# EAGLE schematic TheSiS (EAGLE 9.6.2)
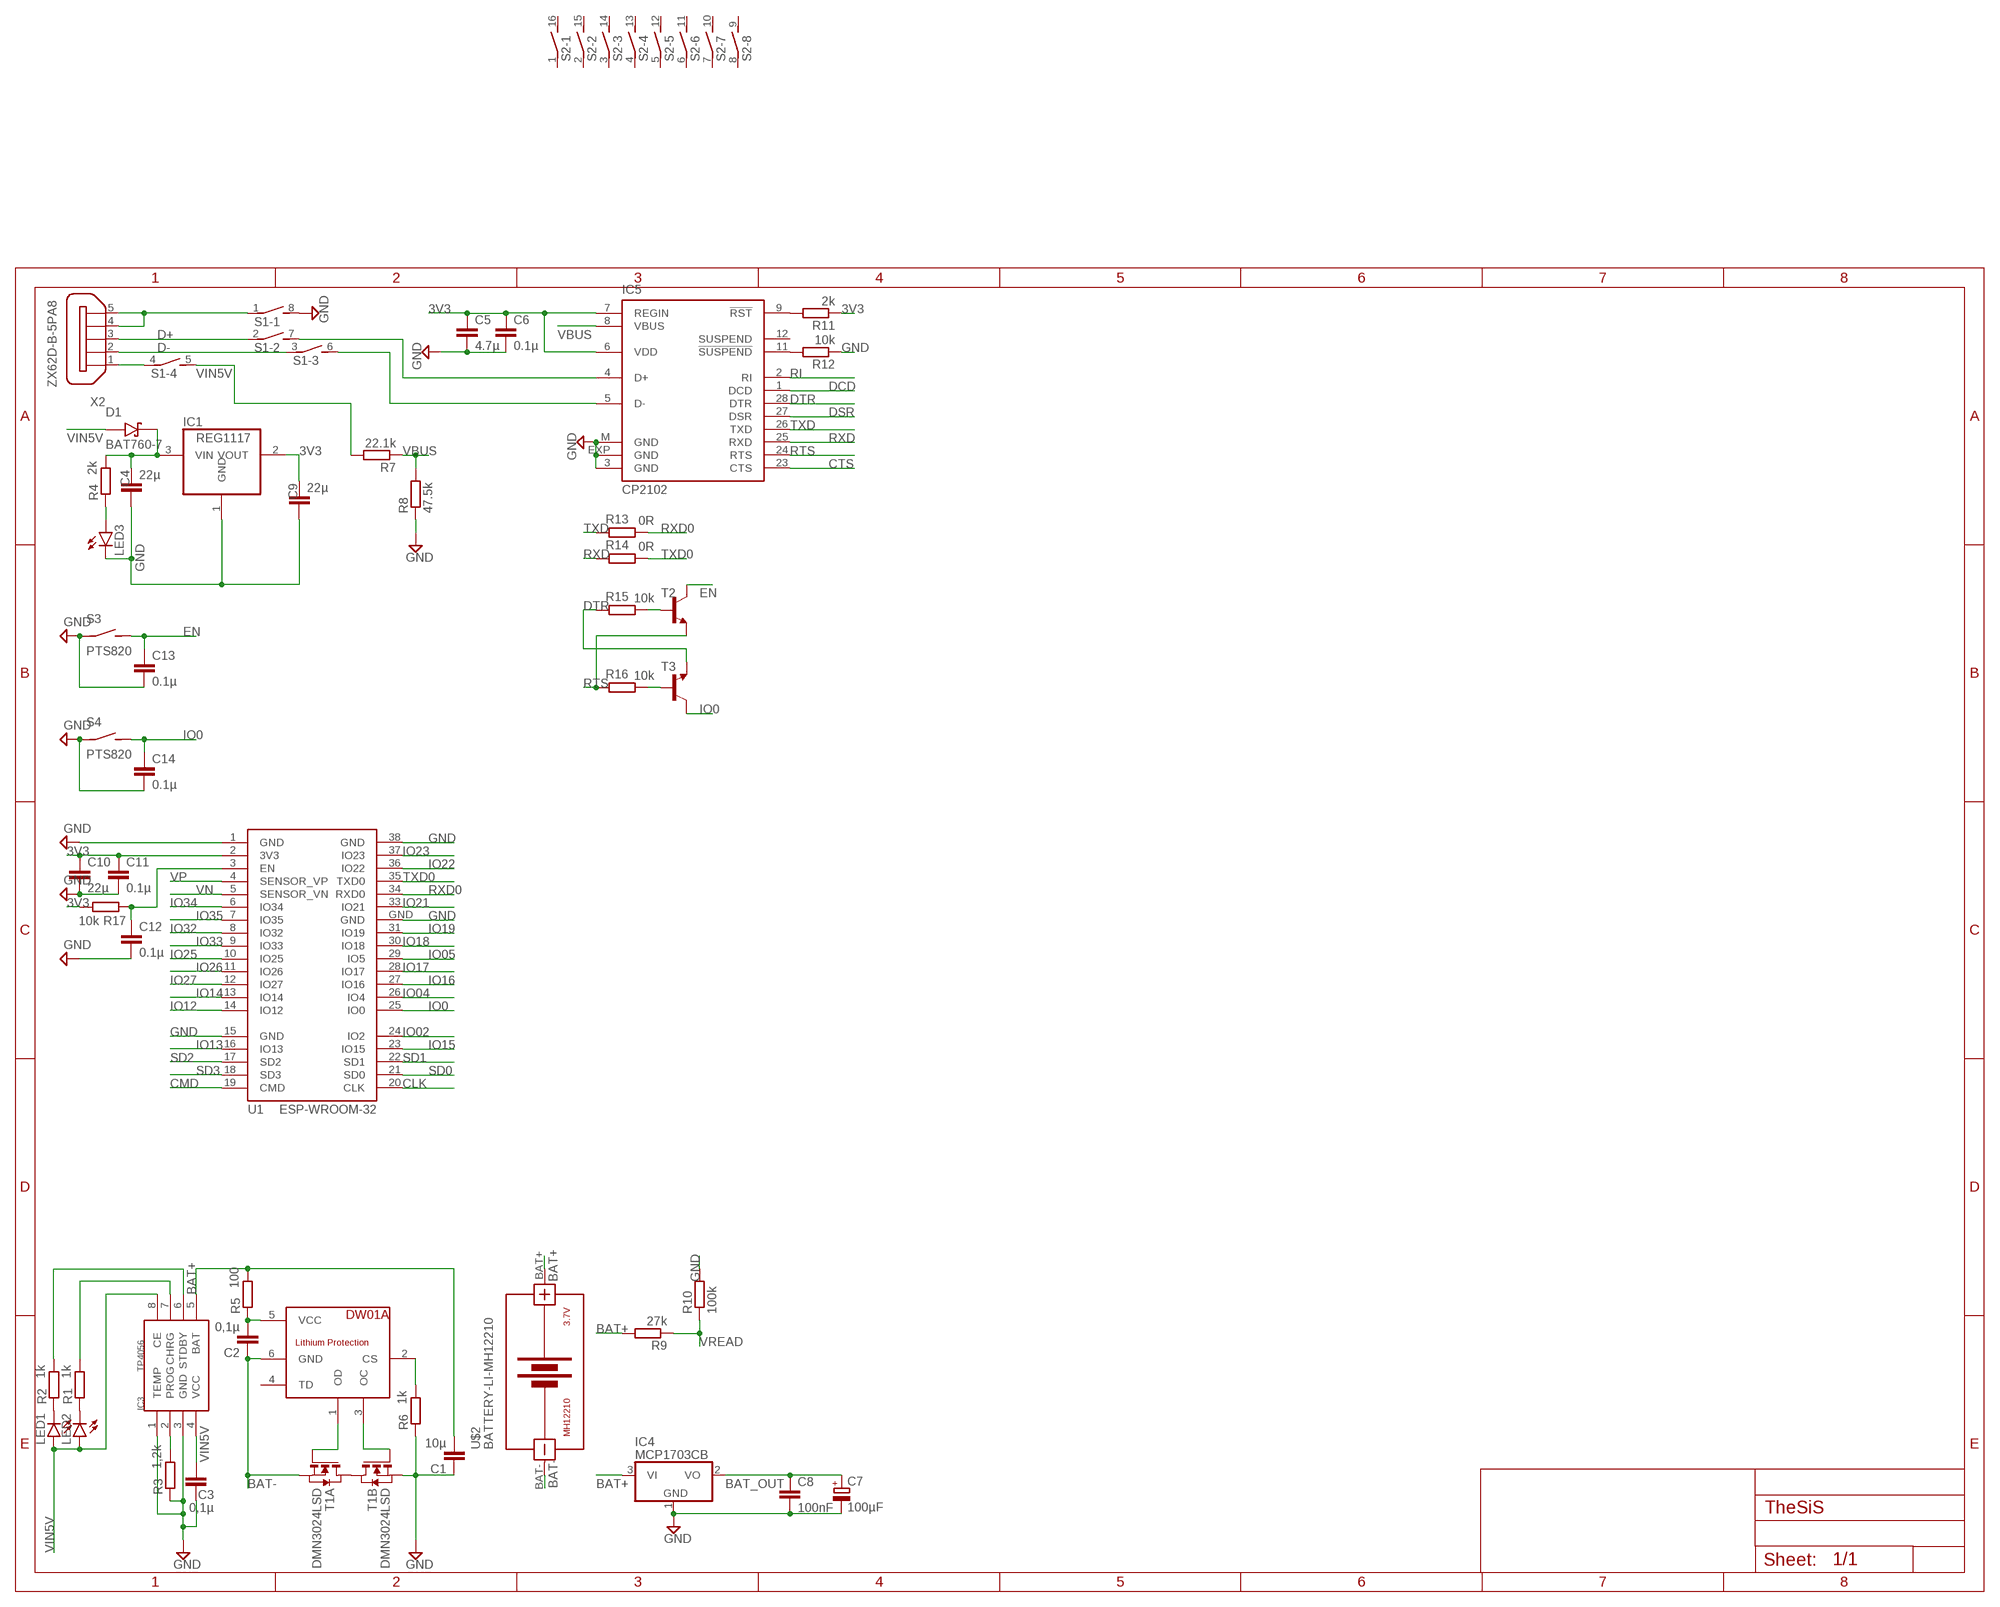
[diagram p0: schematic, sheet 1]

## Parts
C1  10µ  C-EUC0603K  [C0603K]
C2  0,1µ  C-EUC0805K  [C0805K]
C3  0,1µ  C-EUC0805K  [C0805K]
C4  22µ  C-EUC0805  [C0805]
C5  4.7µ  C-EUC0805  [C0805]
C6  0.1µ  C-EUC0805  [C0805]
C7  100µF  CPOL-EUE2,5-6E  [E2,5-6E]
C8  100nF  C-EUC0805  [C0805]
C9  22µ  C-EUC0805  [C0805]
C10  22µ  C-EUC0805  [C0805]
C11  0.1µ  C-EUC0805  [C0805]
C12  0.1µ  C-EUC0805  [C0805]
C13  0.1µ  C-EUC0805  [C0805]
C14  0.1µ  C-EUC0805  [C0805]
D1  BAT760-7  [SOD2513X120N]
IC1  REG1117  [SOT223]
IC3  TP4056  [SOP-8]
IC4  MCP1703CB  [SOT23]
IC5  CP2102  [MLP28]
LED1  LEDCHIP-LED0805  [CHIP-LED0805]
LED2  LEDCHIP-LED0805  [CHIP-LED0805]
LED3  LEDCHIP-LED0805  [CHIP-LED0805]
R1  1k  R-EU_R0603  [R0603]
R2  1k  R-EU_R0603  [R0603]
R3  1,2k  R-EU_R0603  [R0603]
R4  2k  R-EU_R0805  [R0805]
R5  100  R-EU_R0603  [R0603]
R6  1k  R-EU_R0603  [R0603]
R7  22.1k  R-EU_R0805  [R0805]
R8  47.5k  R-EU_R0805  [R0805]
R9  27k  R-EU_R0805  [R0805]
R10  100k  R-EU_R0805  [R0805]
R11  2k  R-EU_R0805  [R0805]
R12  10k  R-EU_R0805  [R0805]
R13  0R  R-EU_R0805  [R0805]
R14  0R  R-EU_R0805  [R0805]
R15  10k  R-EU_R0805  [R0805]
R16  10k  R-EU_R0805  [R0805]
R17  10k  R-EU_R0805  [R0805]
S1  DIP04S  [DIP04S]
S2  DIP08S  [DIP08S]
S3  PTS820  [PTS820]
S4  PTS820  [PTS820]
T1  DMN3024LSD  [TSSOP-8]
T2  -NPN-SOT23-EBC  [SOT23-EBC]
T3  -NPN-SOT23-EBC  [SOT23-EBC]
U1  ESP-WROOM-32  [ESP-WROOM-32]
U$1  DW01A  [SOT23-6]
U$2  BATTERY-LI-MH12210  [BATTERY-LI-MH12210]
X2  ZX62D-B-5PA8  [ZX62D-B-5PA8]

## Nets
3V3: C5.1 C6.1 C9.1 C10.1 C11.1 IC1.2(VOUT) IC5.6(VDD) IC5.7(REGIN) R11.1 R17.2 U1.2(3V3)
BAT+: C1.2 IC3.5(BAT) IC4.3(VI) R5.2 R9.2 U$2.BAT+
BAT-: C2.1 T1.2(A:S) T1.3(A:S) U$1.6(GND) U$2.BAT-
BAT_OUT: C7.+ C8.1 IC4.2(VO)
CLK: U1.20(CLK)
CMD: U1.19(CMD)
CTS: IC5.23(CTS)
D+: IC5.4(D+) S1.7
D-: IC5.5(D-) S1.6
DCD: IC5.1(DCD)
DSR: IC5.27(DSR)
DTR: IC5.28(DTR) R15.2 T3.E
EN: C13.1 S3.2(S) T2.C
GND: C1.1 C3.1 C4.2 C5.2 C6.2 C7.- C8.2 C9.2 C10.2 C11.2 C12.2 C13.2 C14.2 IC1.1(GND) IC3.1(TEMP) IC3.3(GND) IC4.1(GND) IC5.3(GND) IC5.EXP(GND) IC5.M(GND) LED3.C R3.1 R6.1 R8.1 R10.2 R12.1 S1.8 S3.1(P) S4.1(P) T1.6(B:S) T1.7(B:S) U1.1(GND) U1.15(GND) U1.38(GND) U1.GND
IO0: C14.1 S4.2(S) T3.C U1.25(IO0)
IO02: U1.24(IO2)
IO04: U1.26(IO4)
IO05: U1.29(IO5)
IO12: U1.14(IO12)
IO13: U1.16(IO13)
IO14: U1.13(IO14)
IO15: U1.23(IO15)
IO16: U1.27(IO16)
IO17: U1.28(IO17)
IO18: U1.30(IO18)
IO19: U1.31(IO19)
IO21: U1.33(IO21)
IO22: U1.36(IO22)
IO23: U1.37(IO23)
IO25: U1.10(IO25)
IO26: U1.11(IO26)
IO27: U1.12(IO27)
IO32: U1.8(IO32)
IO33: U1.9(IO33)
IO34: U1.6(IO34)
IO35: U1.7(IO35)
N$1: T1.1(A:D) T1.8(B:D)
N$2: IC3.2(PROG) R3.2
N$3: IC3.6(STDBY) R2.2
N$4: IC3.7(CHRG) R1.2
N$5: R6.2 U$1.2(CS)
N$6: LED1.C R2.1
N$7: LED2.C R1.1
N$8: T1.4(A:G) U$1.1(OD)
N$9: T1.5(B:G) U$1.3(OC)
N$10: LED3.A R4.1
N$11: C2.2 R5.1 U$1.5(VCC)
N$12: S1.4 X2.1
N$13: IC5.9(!RST) R11.2
N$14: IC5.11(!SUSPEND) R12.2
N$15: S1.1 X2.4 X2.5
N$16: S1.2 X2.3
N$17: S1.3 X2.2
N$18: R15.1 T2.B
N$19: R16.1 T3.B
N$20: C12.1 R17.1 U1.3(EN)
RI: IC5.2(RI)
RTS: IC5.24(RTS) R16.2 T2.E
RXD: IC5.25(RXD) R14.2
RXD0: R13.1 U1.34(RXD0)
SD0: U1.21(SD0)
SD1: U1.22(SD1)
SD2: U1.17(SD2)
SD3: U1.18(SD3)
TXD: IC5.26(TXD) R13.2
TXD0: R14.1 U1.35(TXD0)
VBUS: IC5.8(VBUS) R7.1 R8.2
VIN5V: C3.2 C4.1 D1.A D1.C(K) IC1.3(VIN) IC3.4(VCC) IC3.8(CE) LED1.A LED2.A R4.2 R7.2 S1.5
VN: U1.5(SENSOR_VN)
VP: U1.4(SENSOR_VP)
VREAD: R9.1 R10.1
Unconnected: IC5.12(SUSPEND) S2.1 S2.2 S2.3 S2.4 S2.5 S2.6 S2.7 S2.8 S2.9 S2.10 S2.11 S2.12 S2.13 S2.14 S2.15 S2.16 U$1.4(TD) X2.S1 X2.S2 X2.S3 X2.S4

## Library data of the parts
C1-C6 C8-C14 = rcl:C-EU: CAPACITOR, European symbol; SPICEPREFIX: C
C7 = rcl:CPOL-EU: POLARIZED CAPACITOR, European symbol; SPICEPREFIX: C
D1 = BAT760-7:BAT760-7: Diode Schottky 30V 1A Surface Mount SOD-323 Check prices <https://pricing.snapeda.com/search/part/BAT760-7/?ref=eda>; AVAILABILITY: Good; DESCRIPTION: Diode Schottky 30V 1A Surface Mount SOD-323; MF: Diodes Inc.; MP: BAT760-7; PACKAGE: SOD-323 Diodes Inc.; PRICE: None; PURCHASE-URL: https://pricing.snapeda.com/search/part/BAT760-7/?ref=eda
IC1 = burr-brown:REG1117: 800mA and 1A Low Dropout (LDO) Positive Regulator 1.8V, 2.5V, 2.85V, 3.3V, 5V, and Adj; MPN: REG1117; OC_FARNELL: 1097566; OC_NEWARK: 14P6981
IC3 = TP4056:TP4056
IC4 = linear:MCP1703: 250 mA, 16V, Low Quiescent Current LDO Regulator Source: http://ww1.microchip.com/downloads/en/DeviceDoc/22049b.pdf
IC5 = silabs:CP210*: Single-Chip USB to UART Bridge Source: www.silabs.com .. CP2101.pdf / cp2102.pdf; MF: FARNELL; MPN: CP2102-GM; OC_FARNELL: 9282130; OC_NEWARK: 30K5635
LED1-LED3 = led:LED: LED OSRAM: - CHIPLED LG R971, LG N971, LY N971, LG Q971, LY Q971, LO R971, LY R971 LH N974, LH R974 LS Q976, LO Q976, LY Q976 LO Q996 - Hyper CHIPLED LW Q18S LB Q993, LB Q99A, LB R99A - SideLED LS A670, LO A670, LY A670, LG A670, LP A670 LB A673, LV A673, LT A673, LW A673 LH A674 LY A675 LS A676, LA A676, LO A676, LY A676, LW A676 LS A679, LY A679, LG A679 - Hyper Micro SIDELED® LS Y876, LA Y876, LO Y876, LY Y876 LT Y87S - SmartLED LW L88C, LW L88S LB L89C, LB L89S, LG L890 LS L89K, LO L89K, LY L89K LS L896, LA L896, LO L896, LY L896 - TOPLED LS T670, LO T670, LY T670, LG T670, LP T670 LSG T670, LSP T670, LSY T670, LOP T670, LYG T670 LG T671, LOG T671, LSG T671 LB T673, LV T673, LT T673, LW T673 LH T674 LS T676, LA T676, LO T676, LY T676, LB T676, LH T676, LSB T676, LW T676 LB T67C, LV T67C, LT T67C, LS T67K, LO T67K, LY T67K, LW E67C LS E67B, LA E67B, LO E67B, LY E67B, LB E67C, LV E67C, LT E67C LW T67C LS T679, LY T679, LG T679 LS T770, LO T770, LY T770, LG T770, LP T770 LB T773, LV T773, LT T773, LW T773 LH T774 LS E675, LA E675, LY E675, LS T675 LS T776, LA T776, LO T776, LY T776, LB T776 LHGB T686 LT T68C, LB T68C - Hyper Mini TOPLED® LB M676 - Mini TOPLED Santana® LG M470 LS M47K, LO M47K, LY M47K Source: http://www.osram.convergy.de LUXEON: - LUMILED® LXK2-PW12-R00, LXK2-PW12-S00, LXK2-PW14-U00, LXK2-PW14-V00 LXK2-PM12-R00, LXK2-PM12-S00, LXK2-PM14-U00 LXK2-PE12-Q00, LXK2-PE12-R00, LXK2-PE12-S00, LXK2-PE14-T00, LXK2-PE14-U00 LXK2-PB12-K00, LXK2-PB12-L00, LXK2-PB12-M00, LXK2-PB14-N00, LXK2-PB14-P00, LXK2-PB14-Q00 LXK2-PR12-L00, LXK2-PR12-M00, LXK2-PR14-Q00, LXK2-PR14-R00 LXK2-PD12-Q00, LXK2-PD12-R00, LXK2-PD12-S00 LXK2-PH12-R00, LXK2-PH12-S00 LXK2-PL12-P00, LXK2-PL12-Q00, LXK2-PL12-R00 Source: www.luxeon.com KINGBRIGHT: KA-3528ASYC Source: www.kingbright.com
R1-R17 = rcl:R-EU_: RESISTOR, European symbol; SPICEPREFIX: R
S1 = switch-dil:DIP04S: DIL/CODE SWITCH; OC_FARNELL: unknown; OC_NEWARK: unknown
S2 = switch-dil:DIP08S: DIL/CODE SWITCH; OC_FARNELL: unknown; OC_NEWARK: unknown
S3 S4 = switch-ck:PTS820: C&K Components PTS820 Series Microminiature SMT Top Actuated
T1 = FS8205A:DMN3024LSD: DUAL N-CHANNEL ENHANCEMENT MODE MOSFET data sheet <http://goo.gl/dRgboR> Dave.Calaway Eagle Library <https://goo.gl/Muy1Tr>
T2 T3 = transistor:*-NPN-: NPN Transistror BF959 corrected 2008.03.06
U1 = esp32:ESP-WROOM-32: Espressif Systems ESP-WROOM-32
U$1 = DW01A:DW01A
U$2 = diy-modules:BATTERY-LI-MH12210: Lithium-Ion MH12210 Rechargeable Battery Panasonic NCR18650PF battery datasheet available here: https://industrial.panasonic.com/cdbs/www-data/pdf2/ACI4000/ACI4000C12.pdf Click here to find device on ebay.com <http://www.ebay.com/sch/ncr18650b+battery>
X2 = zx62d-b-5pa8-oshpark_10:ZX62D-B-5PA8: Micro USB Type B Connector - Standard, Shell Through Hole Source: http://www.hirose.co.jp/cataloge_hp/ed_ZX_20140804.pdf; MF: Hirose; MPN: ZX62D-B-5PA8; OC_FARNELL: 2300438; OC_NEWARK: 69W0712